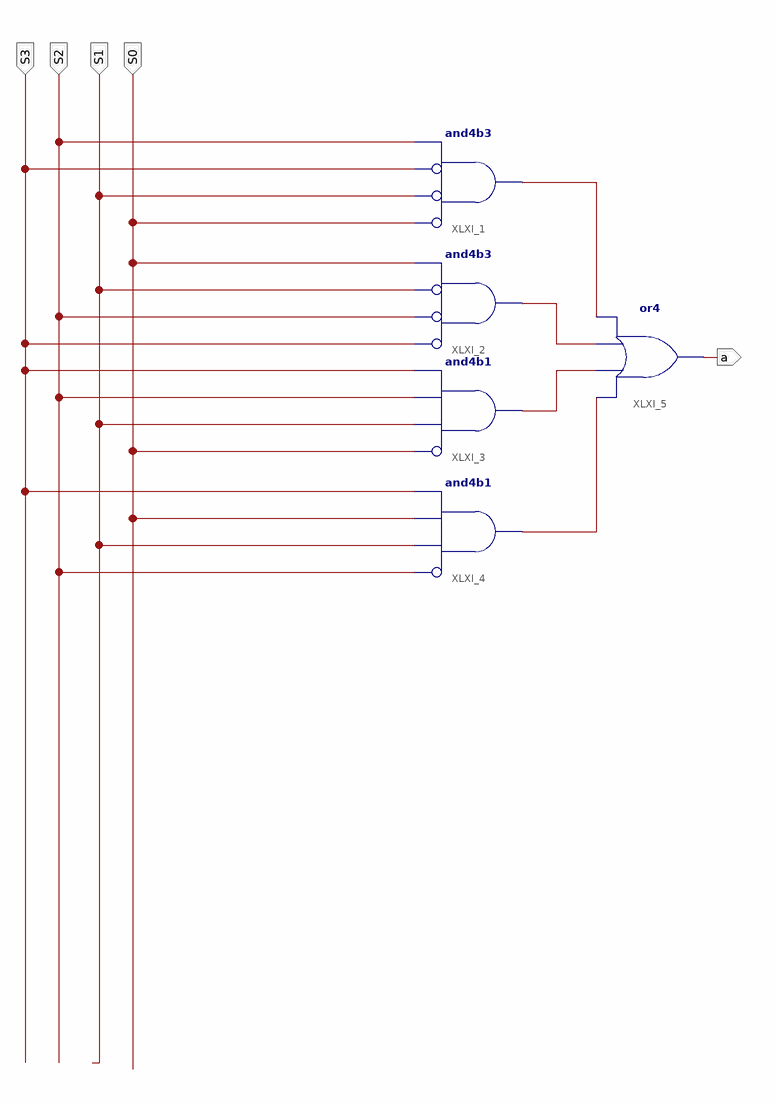
[diagram p0: schematic sheet 1]
// Xilinx ISE schematic testSchematic.sch (spartan6) as structural Verilog: 5 symbols, 5 ports
module testSchematic (
  input  S3,
  input  S2,
  input  S1,
  input  S0,
  output a
);

  wire XLXN_7, XLXN_8, XLXN_9, XLXN_10;

  and XLXI_1 (XLXN_7, ~S0, ~S1, ~S3, S2);  // and4b3
  and XLXI_2 (XLXN_8, ~S3, ~S2, ~S1, S0);  // and4b3
  and XLXI_3 (XLXN_9, ~S0, S1, S2, S3);  // and4b1
  and XLXI_4 (XLXN_10, ~S2, S1, S0, S3);  // and4b1
  or XLXI_5 (a, XLXN_10, XLXN_9, XLXN_8, XLXN_7);
endmodule
